# Altium schematic sheet EFM32_IO.SchDoc
size A4; DocumentNumber: 5; SheetNumber: 5; SheetTotal: 21; SheetName: Microcontroller IO
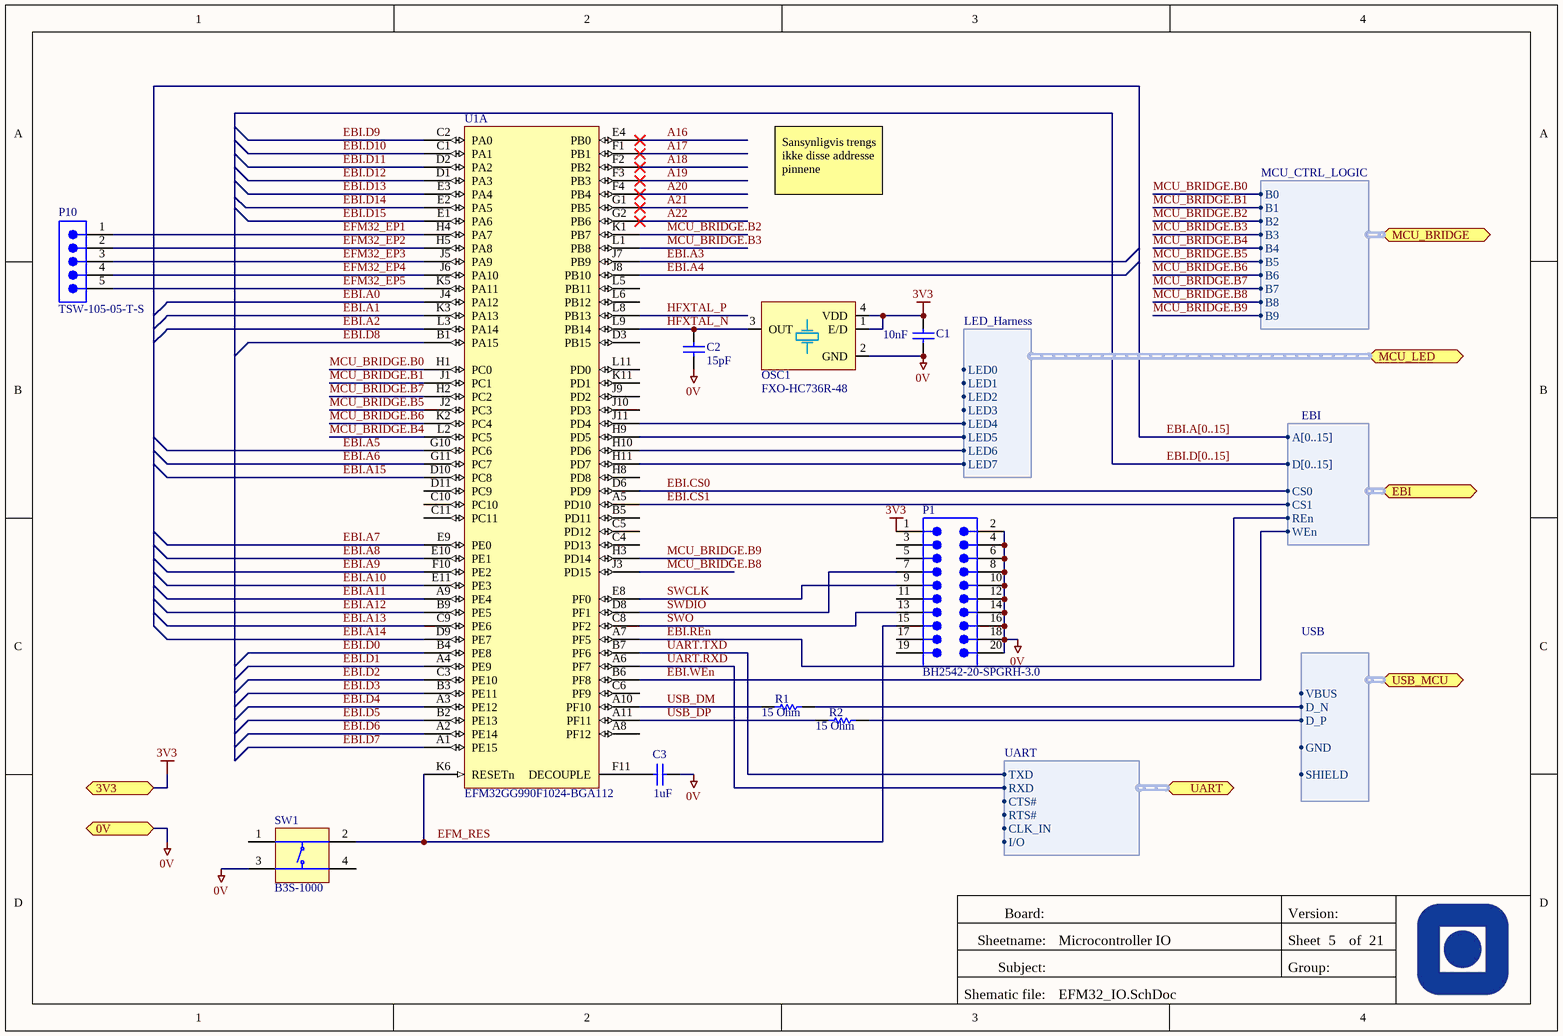
[diagram p0: EFM32_IO.SchDoc]

## Parts
C1  value 10nF  [CAPC0603(1608)100_L]  (hidden comment: CAP 10nF 16V 0603(1608))
C2  value 15pF  [CAPC0603(1608)100_N]  (hidden comment: CAP 15pF 16V 0603(1608))
C3  value 1uF  [CAPC0603(1608)100_M]  (hidden comment: CAP 1uF 16V 0603(1608))
OSC1  FXO-HC736R-48  [FXO-HC73]
P1  BH2542-20-SPGRH-3.0  [PCE-BH2542-20-SPGRH-3.0]
P10  TSW-105-05-T-S  [SMTC-TSW-105-05-X-S]
R1  value 15 Ohm  [RESC0603(1608)_L]  (hidden comment: 15R 5% 0603(1608))
R2  value 15 Ohm  [RESC0603(1608)_L]  (hidden comment: 15R 5% 0603(1608))
SW1  B3S-1000  [OMRON-B3S-1000-4_V]
U1  EFM32GG990F1024-BGA112  [ENMR-BGA112]  (part A of 2)

## Ports
0V, 3V3, EBI (harness EBI), MCU_BRIDGE (harness MCU_CTRL_LOGIC), MCU_LED (harness LED_Harness), UART (harness UART), USB_MCU (harness USB)

## Harnesses
EBI: A[0..15], D[0..15], CS0, CS1, REn, WEn
MCU_CTRL_LOGIC: B0, B1, B2, B3, B4, B5, B6, B7, B8, B9
USB: D_P, D_N, VBUS, GND, SHIELD
LED_Harness: LED0, LED1, LED2, LED3, LED4, LED5, LED6, LED7
UART: TXD, RXD, CTS#, RTS#, CLK_IN, I/O

## Nets
0V: C1.1 C2.1 C3.2 OSC1.2(GND) P1.2 P1.4 P1.6 P1.8 P1.10 P1.12 P1.14 P1.16 P1.18 P1.20 SW1.3 ; port 0V
3V3: C1.2 OSC1.1(E/D) OSC1.4(VDD) P1.1 ; port 3V3
A16: U1.E4(PB0)
A17: U1.F1(PB1)
A18: U1.F2(PB2)
A19: U1.F3(PB3)
A20: U1.F4(PB4)
A21: U1.G1(PB5)
A22: U1.G2(PB6)
EBI.A0: U1.J4(PA12)
EBI.A1: U1.K3(PA13)
EBI.A2: U1.L3(PA14)
EBI.A3: U1.J7(PB9)
EBI.A4: U1.J8(PB10)
EBI.A5: U1.G10(PC6)
EBI.A6: U1.G11(PC7)
EBI.A7: U1.E9(PE0)
EBI.A8: U1.E10(PE1)
EBI.A9: U1.F10(PE2)
EBI.A10: U1.E11(PE3)
EBI.A11: U1.A9(PE4)
EBI.A12: U1.B9(PE5)
EBI.A13: U1.C9(PE6)
EBI.A14: U1.D9(PE7)
EBI.A15: U1.D10(PC8)
EBI.CS0: U1.D6(PD9) ; port EBI.CS0
EBI.CS1: U1.A5(PD10) ; port EBI.CS1
EBI.D0: U1.B4(PE8)
EBI.D1: U1.A4(PE9)
EBI.D2: U1.C3(PE10)
EBI.D3: U1.B3(PE11)
EBI.D4: U1.A3(PE12)
EBI.D5: U1.B2(PE13)
EBI.D6: U1.A2(PE14)
EBI.D7: U1.A1(PE15)
EBI.D8: U1.B1(PA15)
EBI.D9: U1.C2(PA0)
EBI.D10: U1.C1(PA1)
EBI.D11: U1.D2(PA2)
EBI.D12: U1.D1(PA3)
EBI.D13: U1.E3(PA4)
EBI.D14: U1.E2(PA5)
EBI.D15: U1.E1(PA6)
EBI.REn: U1.A7(PF5) ; port EBI.REn
EBI.WEn: U1.B6(PF8) ; port EBI.WEn
EFM32_EP1: P10.1 U1.H4(PA7)
EFM32_EP2: P10.2 U1.H5(PA8)
EFM32_EP3: P10.3 U1.J5(PA9)
EFM32_EP4: P10.4 U1.J6(PA10)
EFM32_EP5: P10.5 U1.K5(PA11)
EFM_RES: P1.15 SW1.2 U1.K6(RESETn)
HFXTAL_N: C2.2 OSC1.3(OUT) U1.L9(PB14)
HFXTAL_P: U1.L8(PB13)
MCU_BRIDGE.B0: U1.H1(PC0) ; port MCU_BRIDGE.B0
MCU_BRIDGE.B1: U1.J1(PC1) ; port MCU_BRIDGE.B1
MCU_BRIDGE.B2: U1.K1(PB7) ; port MCU_BRIDGE.B2
MCU_BRIDGE.B3: U1.L1(PB8) ; port MCU_BRIDGE.B3
MCU_BRIDGE.B4: U1.L2(PC5) ; port MCU_BRIDGE.B4
MCU_BRIDGE.B5: U1.J2(PC3) ; port MCU_BRIDGE.B5
MCU_BRIDGE.B6: U1.K2(PC4) ; port MCU_BRIDGE.B6
MCU_BRIDGE.B7: U1.H2(PC2) ; port MCU_BRIDGE.B7
MCU_BRIDGE.B8: U1.J3(PD15) ; port MCU_BRIDGE.B8
MCU_BRIDGE.B9: U1.H3(PD14) ; port MCU_BRIDGE.B9
SWCLK: P1.9 U1.E8(PF0)
SWDIO: P1.7 U1.D8(PF1)
SWO: P1.13 U1.C8(PF2)
UART.RXD: U1.A6(PF7) ; port UART.RXD
UART.TXD: U1.B7(PF6) ; port UART.TXD
USB_DM: R1.1 U1.A10(PF10)
USB_DP: R2.1 U1.A11(PF11)
NetC3_1: C3.1 U1.F11(DECOUPLE)
NetR1_2: R1.2 ; port USB_MCU.D_N
NetR2_2: R2.2 ; port USB_MCU.D_P
NetU1_H9: U1.H9(PD5) ; port MCU_LED.LED5
NetU1_H10: U1.H10(PD6) ; port MCU_LED.LED6
NetU1_H11: U1.H11(PD7) ; port MCU_LED.LED7
NetU1_J11: U1.J11(PD4) ; port MCU_LED.LED4

Not connected (* = marked no-connect by the designer): P1 3 5 11 17 19; SW1 1 4; U1 A8(PF12) B5(PD11) C4(PD13) C5(PD12) C6(PF9) C10(PC10) C11(PC11) D3(PB15) D11(PC9) H8(PD8) J9(PD2) J10(PD3) K11(PD1) L5(PB11) L6(PB12) L11(PD0)

## Buses and harness runs
bus EBI.A[0..15]
bus EBI.D[0..15]

## Notes on the sheet
- Sansynligvis trengs ikke disse addresse pinnene
- Board:
- Version:
- Sheetname:
- Subject:
- Group:
- Sheet
- of
- Shematic file:

## Library data of the parts
C1 = CMP-1035-02309-1: CAP 10nF 16V ±1% 0603 (1608 Metric) Thickness 1mm SMD; Case-Metric: 1608; Tolerance: Â±1%; Case-EIA: 0603; Rated Voltage: 16 V; Technology: SMT; Max Thickness: 1 mm
C2 = CMP-1035-00665-1: CAP 15pF 16V ±0.25pF 0603 (1608 Metric) Thickness 1mm SMD; Case-Metric: 1608; Case-EIA: 0603; Tolerance: Â±0.25pF; Technology: SMT; Max Thickness: 1 mm; Rated Voltage: 16 V
C3 = CMP-1035-02737-1: CAP 1uF 16V ±10% 0603 (1608 Metric) Thickness 1mm SMD; Case-Metric: 1608; Tolerance: Â±10%; Case-EIA: 0603; Rated Voltage: 16 V; Max Thickness: 1 mm; Technology: SMT
P1 = CMP-0605-00003-2: Box Header, Pitch 2.54 mm, 2x10 Position, Height 9 mm, Tail Length 3 mm; Manufacturer: Pinchao Electronic; Insulator Material: NY-6T; Dielectric Withstaanding: AC 500 V; Insulator resistance (Min.): 1000 Megohms; Current Rating: 3 Amps; Pitch: 2.54 mm; Plating: Gold Flash; No. of positions: 20; No. of Rows: 2; ComponentLink1URL: http://www.suzhoupinchao.com/; Mounting Technology: Through Hole; Operating Temperature: -40 to 105 degC; ComponentLink1Description: Manufacturer URL; PackageReference: BH2542-20-SPGRH-3.0; PackageDescription: Box Header, Pitch 2.54 mm, 2x10 Position, Height 9 mm, Tail Length 3 mm; PartNumber: BH2542-20-SPGRH-3.0; Connector Type: Box Header
P10 = CMP-1024-00364-1: 0.025" SQ Post Header, Through-hole, Vertical, -55 to 105 degC, 2.54 mm Pitch, 5-Pin, Male, RoHS; Manufacturer: Samtec; Pitch: 2.54 mm; ComponentLink1URL: http://www.samtec.com; PackageReference: TSW-105-05-X-S; ComponentLink2URL: http://www.samtec.com/documents/webfiles/pdf/TSW_TH.PDF; ComponentLink2Description: Datasheet; Orientation: Vertical; ComponentLink1Description: Manufacturer URL; ComponentLink3URL: http://www.samtec.com/documents/webfiles/cpdf/TSW-XXX-XX-XXX-X-XX-XXX-MKT.pdf; Mounting Technology: Through-hole; PackageVersion: DM, 8/1988; DatasheetVersion: F-214; Temperature Range: -55 to 105 degC; PartNumber: TSW-105-05-T-S; PackageDescription: .025[0.64] SQ. Post Terminal Strip Assembly; RoHS: True; ComponentLink3Description: Package Specification
R1 R2 = CMP-1012-00030-1: 15R 0.1W 5% 0603 (1608 Metric)  SMD; Case-EIA: 0603; Case-Metric: 1608; Tolerance: 5 %; Technology: SMT; Power: 0.1 W
SW1 = CMP-1677-00001-3: Sealed Tactile Switch, SPST-NO, 3 to 24 V, -25 to 70 degC, 4-Pin SMD, RoHS, Bulk; Current Rating: 50 mA; Voltage Rating: 24 V; Packaging: Bulk; PackageDescription: 4-Pin Surface Mount Device, Body 6.6 x 6 mm; Height: 4.3 mm; RoHSCompliant: true; REACH SVHC: No SVHC; Package Quantity: 1500; Mounting Technology: Surface Mount; Contact Plating: Silver; PackageReference: B3S-1000; Min Operating Temperature: -25 degC; DatasheetVersion: 10/2014; Mount: Surface Mount; Length: 6.6 mm; Max Operating Temperature: 70 degC
U1 = CMP-0270-00024-1: EFM32 Giant Gecko, M3 ARM Cortex CPU, 1024 KB Flash, 128 KB RAM, 1.85 - 3.8 V Supply, 48 MHz Max Speed, -40 to 85 degC, 112-Pin BGA, RoHS Compliant; LESENSE: Y; RAM (KB): 128; Flash (KB): 1024; LCD: 8x34; OPAMPS: 3; GPIO: 87; Max Speed (MHz): 48; ARM Cortex CPU: M3; DatasheetVersion: Rev 1.00; PartNumber: EFM32GG990F1024-BGA112; ComponentLink3Description: Package Specification; Subcategory: EFM32 Giant Gecko; PackageReference: BGA112; ComponentLink3URL: http://cdn.energymicro.com/dl/devices/pdf/d0007_efm32g290_datasheet.pdf; ComponentLink2Description: Datasheet; USB: Y; PackageDescription: 112-Pin Ball Grid Array, Body 10 x 10 mm, Pitch 0.8 mm; PackageVersion: Rev. 97SPP01315A_X03_06Jun11; ComponentLink1Description: Manufacturer URL; Supply Voltage (V): 1.85 - 3.8; Mounting Technology: Surface Mount; ComponentLink1URL: http://www.energymicro.com/; Generic Part Number: EFM32GG990; ComponentLink2URL: http://cdn.energymicro.com/dl/devices/pdf/d0046_efm32gg990_datasheet.pdf; PartId: 1
OSC1 = FXO-HC736R-48: Supplier 1: Farnell; Supplier Part Number 1: 1641012RL